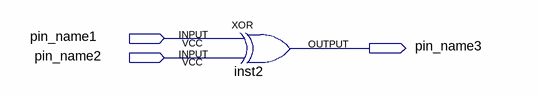
[diagram p0: schematic sheet]
// Quartus schematic Introduction.bdf as structural Verilog: 1 symbols, 3 pins
module Introduction (
  input  pin_name1,
  input  pin_name2,
  output pin_name3
);

  xor inst2 (pin_name3, pin_name1, pin_name2);
endmodule
